# EAGLE design untitled (EAGLE 7.6.0)
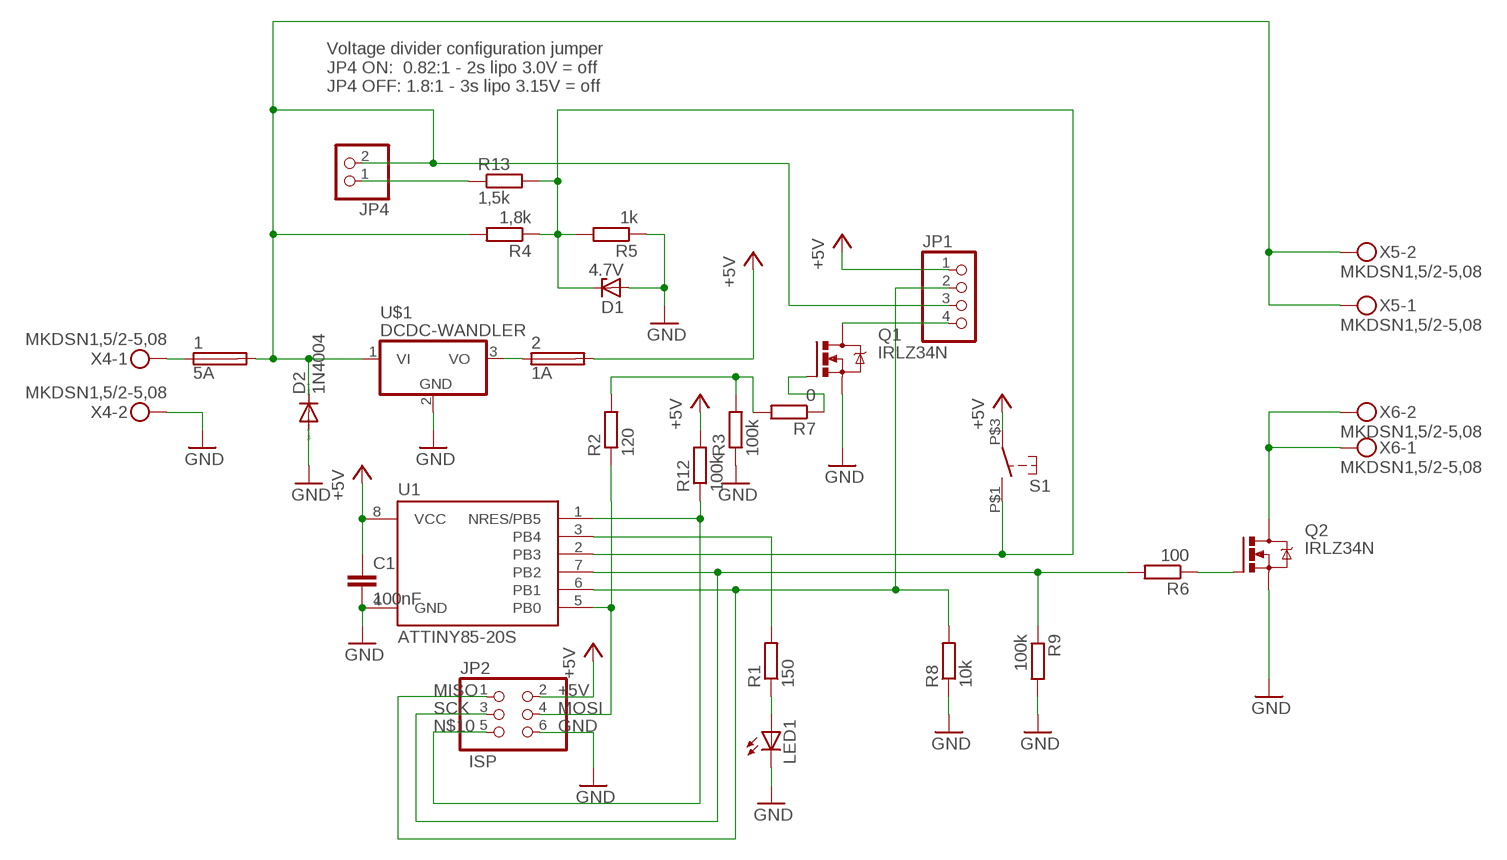
[diagram p0: schematic, sheet 1]

## Parts
1  5A  FUSESH22,5A  [SH22,5A]
2  1A  FUSESH22,5A  [SH22,5A]
C1  100nF  C-EUC0805  [C0805]
D1  4.7V  ZENER-DIODESOT23  [SOT23]
D2  1N4004  [DO41-10]
JP1  PINHD-1X4  [1X04]
JP2  PINHD-2X3  [2X03]
JP4  PINHD-1X2  [1X02]
LED1  LED3MM  [LED3MM]
Q1  IRLZ34N  IRLZ44Z  [TO220BH]
Q2  IRLZ34N  IRLZ44Z  [TO220BH]
R1  150  R-EU_R1206  [R1206]
R2  120  R-EU_R1206  [R1206]
R3  100k  R-EU_R1206  [R1206]
R4  1,8k  R-EU_R1206  [R1206]
R5  1k  R-EU_R1206  [R1206]
R6  100  R-EU_R1206  [R1206]
R7  0  R-EU_R1206  [R1206]
R8  10k  R-EU_R1206  [R1206]
R9  100k  R-EU_R1206  [R1206]
R12  100k  R-EU_R1206  [R1206]
R13  1,5k  R-EU_R1206  [R1206]
S1  SCHLIESSER_TASTSCHALTER  [NAMAE-JTP-1130]
U1  ATTINY85-20S  [SOIC8_EIAJ_208MIL]
U$1  DCDC-WANDLER  [TRACOPOWER-DCDCWANDER-TSR1]
X4  MKDSN1,5/2-5,08  [MKDSN1,5/2-5,08]
X5  MKDSN1,5/2-5,08  [MKDSN1,5/2-5,08]
X6  MKDSN1,5/2-5,08  [MKDSN1,5/2-5,08]

## Nets
+5V: 2.2 C1.1 JP1.1 JP2.2 R12.2 S1.P$3 U1.8(VCC)
GND: C1.2 D1.1(A) D2.A JP2.6 LED1.K(C) Q1.S Q2.S R3.1 R5.1 R8.1 R9.2 U1.4(GND) U$1.2(GND) X4.2
MISO: JP1.2 JP2.1 R8.2 U1.6(PB1)
MOSI: JP2.4 R2.1 U1.5(PB0)
N$1: 1.1 X4.1
N$2: 1.2 D2.C JP1.3 JP4.2 R4.2 U$1.1(VI) X5.1 X5.2
N$3: Q2.D X6.1 X6.2
N$4: Q2.G R6.1
N$6: LED1.A R1.1
N$7: Q1.G R7.1
N$8: R2.2 R3.2 R7.2
N$10: JP2.5 R12.1 U1.1(NRES/PB5)
N$12: R1.2 U1.3(PB4)
N$16: JP4.1 R13.1
N$18: 2.1 U$1.3(VO)
N$21: JP1.4 Q1.D
RESET: D1.3(C) R4.1 R5.2 R13.2 S1.P$1 U1.2(PB3)
SCK: JP2.3 R6.2 R9.1 U1.7(PB2)

## Notes on the sheet
- Voltage divider configuration jumper
  JP4 ON:  0.82:1 - 2s lipo 3.0V = off
  JP4 OFF: 1.8:1 - 3s lipo 3.15V = off
- ISP

## Library data of the parts
1 2 = 0liver:FUSE: Fuse; OC_FARNELL: unknown; OC_NEWARK: unknown
C1 = rcl:C-EU: CAPACITOR, European symbol
D1 = diode:ZENER-DIODE: Z-Diode
D2 = diode:1N4004: DIODE general purpose rectifier, 1 A
JP1 = pinhead:PINHD-1X4: PIN HEADER
JP2 = pinhead:PINHD-2X3: PIN HEADER
JP4 = pinhead:PINHD-1X2: PIN HEADER
LED1 = led:LED: LED OSRAM: - CHIPLED LG R971, LG N971, LY N971, LG Q971, LY Q971, LO R971, LY R971 LH N974, LH R974 LS Q976, LO Q976, LY Q976 LO Q996 - Hyper CHIPLED LW Q18S LB Q993, LB Q99A, LB R99A - SideLED LS A670, LO A670, LY A670, LG A670, LP A670 LB A673, LV A673, LT A673, LW A673 LH A674 LY A675 LS A676, LA A676, LO A676, LY A676, LW A676 LS A679, LY A679, LG A679 - Hyper Micro SIDELED® LS Y876, LA Y876, LO Y876, LY Y876 LT Y87S - SmartLED LW L88C, LW L88S LB L89C, LB L89S, LG L890 LS L89K, LO L89K, LY L89K LS L896, LA L896, LO L896, LY L896 - TOPLED LS T670, LO T670, LY T670, LG T670, LP T670 LSG T670, LSP T670, LSY T670, LOP T670, LYG T670 LG T671, LOG T671, LSG T671 LB T673, LV T673, LT T673, LW T673 LH T674 LS T676, LA T676, LO T676, LY T676, LB T676, LH T676, LSB T676, LW T676 LB T67C, LV T67C, LT T67C, LS T67K, LO T67K, LY T67K, LW E67C LS E67B, LA E67B, LO E67B, LY E67B, LB E67C, LV E67C, LT E67C LW T67C LS T679, LY T679, LG T679 LS T770, LO T770, LY T770, LG T770, LP T770 LB T773, LV T773, LT T773, LW T773 LH T774 LS E675, LA E675, LY E675, LS T675 LS T776, LA T776, LO T776, LY T776, LB T776 LHGB T686 LT T68C, LB T68C - Hyper Mini TOPLED® LB M676 - Mini TOPLED Santana® LG M470 LS M47K, LO M47K, LY M47K Source: http://www.osram.convergy.de LUXEON: - LUMILED® LXK2-PW12-R00, LXK2-PW12-S00, LXK2-PW14-U00, LXK2-PW14-V00 LXK2-PM12-R00, LXK2-PM12-S00, LXK2-PM14-U00 LXK2-PE12-Q00, LXK2-PE12-R00, LXK2-PE12-S00, LXK2-PE14-T00, LXK2-PE14-U00 LXK2-PB12-K00, LXK2-PB12-L00, LXK2-PB12-M00, LXK2-PB14-N00, LXK2-PB14-P00, LXK2-PB14-Q00 LXK2-PR12-L00, LXK2-PR12-M00, LXK2-PR14-Q00, LXK2-PR14-R00 LXK2-PD12-Q00, LXK2-PD12-R00, LXK2-PD12-S00 LXK2-PH12-R00, LXK2-PH12-S00 LXK2-PL12-P00, LXK2-PL12-Q00, LXK2-PL12-R00 Source: www.luxeon.com KINGBRIGHT: KA-3528ASYC Source: www.kingbright.com
Q1 Q2 = 0liver:IRLZ44Z: N-Channel HEXFET® Power MOSFET Logic Level AUTOMOTIVE MOSFET Source: http://www.irf.com/product-info/datasheets/data/irlz44zpbf.pdf
R1-R9 R12 R13 = rcl:R-EU_: RESISTOR, European symbol
S1 = 0liver:SCHLIESSER_TASTSCHALTER: Tastschalter, Schließer
U1 = _hhn_attiny25_45_85:ATTINY85*: ATMEL ATtiny 85 Packages: P = PDIP 08 30mil S = SOIC 08 EIAJ 208mil Technologies Note: for complete ordering code (temp. range, finish, tape&reel etc.) see www.atmel.com • Supply Voltage: V = (1.8…5.5)V | [blank] = (2.7…5.5)V • Speed: 10 = 10 MHz | 20 = 20 MHz Author: Dipl.-Ing. FH Rainer Bayer HHN Hochschule Heilbronn (Heilbronn University), rainer.bayer@hs-heilbronn.de Ingenieurbüro ing-rb, mail@ing-rb.de
U$1 = 0liver:DCDC-WANDLER
X4-X6 = con-phoenix-508:MKDSN1,5/2-5,08: MKDSN 1,5/ 2-5,08 Printklemme Nennstrom: 13,5 A Nennspannung: 250 V Rastermaß: 5,08 mm Polzahl: 2 Anschlussart: Schraubanschluss Montage: Löten Anschlussrichtung Leiter/Platine: 0 ° Artikelnummer: 1729128 Source: http://eshop.phoenixcontact.com .. 1729128.pdf

## Board
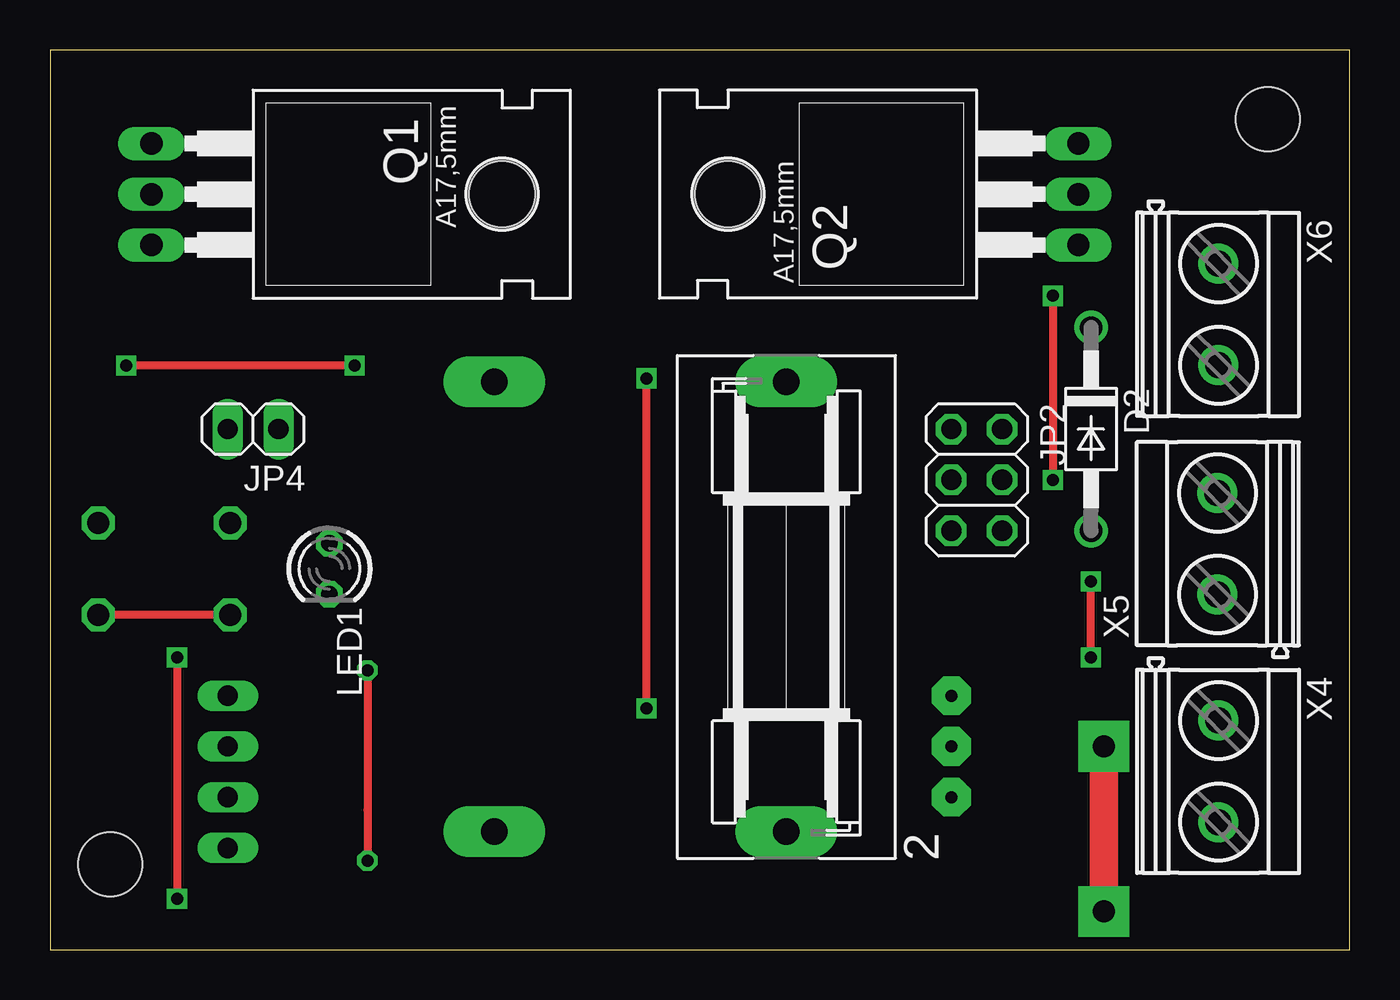
[diagram p1: board, top side]
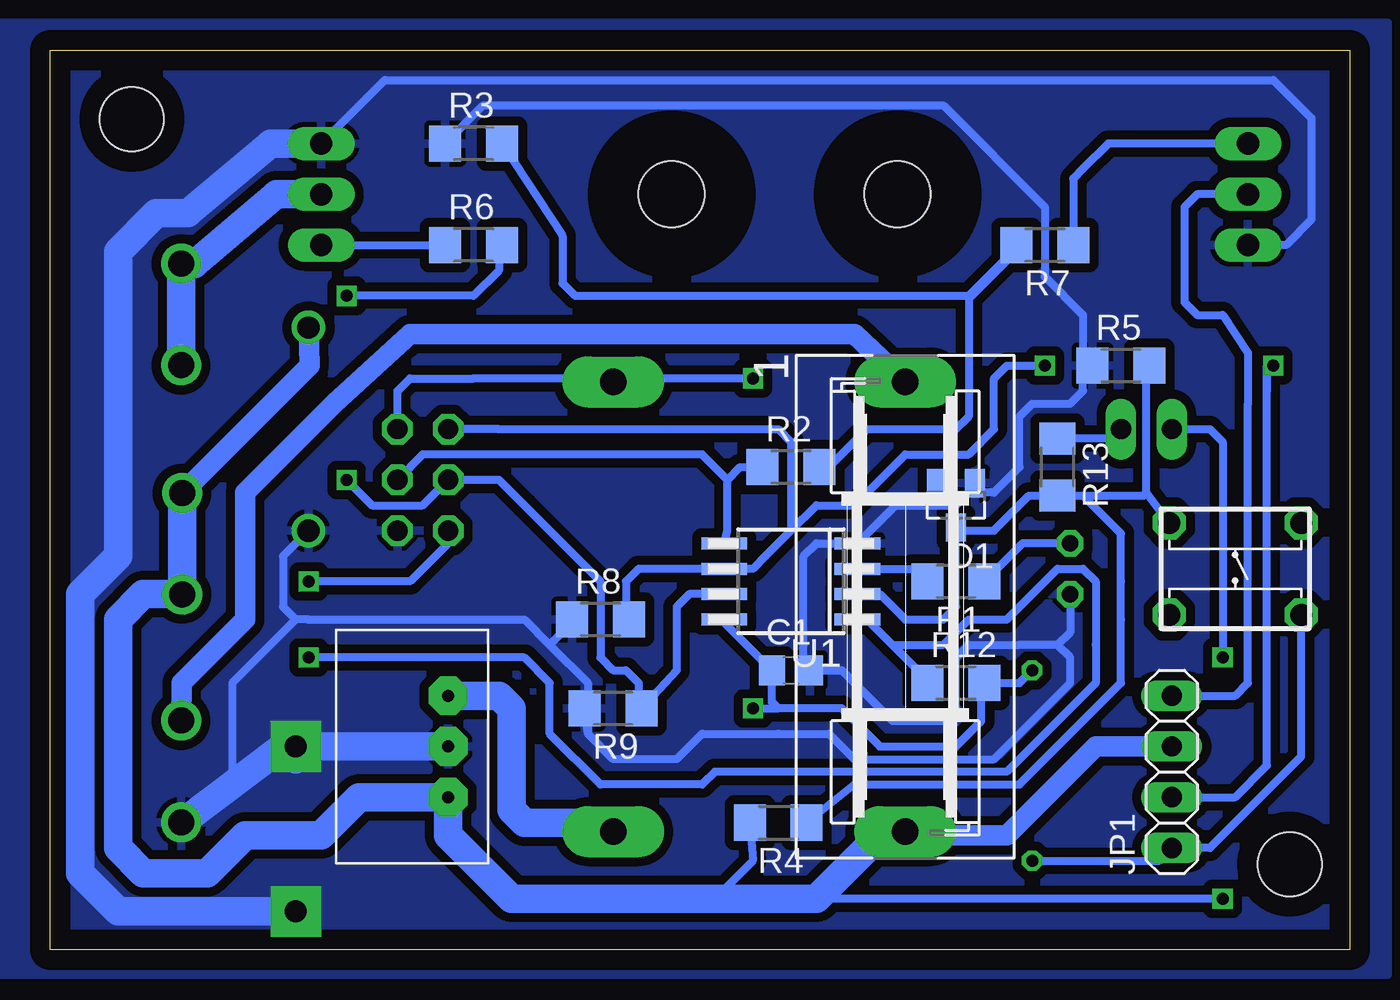
[diagram p2: board, bottom side, seen from below]

Size 65 x 45 mm. Coordinates in mm from the lower left corner, seen from the top.
Outline: 0,0 65,0 65,45 0,45 0,0
Copper layers (1*16): Top 0.035mm / dielectric 1.5mm / Bottom 0.035mm
Design rules "default *": minimum track width 10mil, minimum drill 24mil, track to track 18mil, track to pad 18mil, pad to pad 18mil, via to via 18mil, smd to smd 8mil, copper to edge 40mil, drill to drill 8mil, minimum pad ring 10mil, minimum via ring 8mil, stop-mask expansion 4mil, vias tented up to drill 0mil, thermal gap 10mil
Holes 3.2 mm at 60.91,41.54 3,4.27

### Footprints (pad centres in the part's own frame; a part is rotated, then mirrored left to right if it is on the bottom)
SH22,5A = drill 1.321 pad 2.54 long: 1 -11.252,0; 2 11.252,0
C0805 = smd 1.3 x 1.5: 1 -0.95,0; 2 0.95,0
SOT23 = smd 1 x 1.4: 1 -0.95,-1.1; 2 0.95,-1.1; 3 0,1.1
DO41-10 = drill 1.118: A 5.08,0; C -5.08,0
1X04 = drill 1.016 long: 1 -3.81,0; 2 -1.27,0; 3 1.27,0; 4 3.81,0
2X03 = drill 1.016 octagon: 1 -2.54,-1.27; 2 -2.54,1.27; 3 0,-1.27; 4 0,1.27; 5 2.54,-1.27; 6 2.54,1.27
1X02 = drill 1.016 long: 1 -1.27,0; 2 1.27,0
LED3MM = drill 0.813 octagon: A -1.27,0; K 1.27,0
TO220BH = drill 1.118 long: D 0,-6.35; G -2.54,-6.35; S 2.54,-6.35 | hole 3.302: 0,11.176
R1206 = smd 1.6 x 1.803: 1 -1.422,0; 2 1.422,0
NAMAE-JTP-1130 = drill 1.1 octagon: P$1 3.3,-2.3; P$2 -3.3,-2.3; P$3 3.3,2.3; P$4 -3.3,2.3
SOIC8_EIAJ_208MIL = smd 0.6 x 2.286: 1 -1.905,-3.33; 2 -0.635,-3.33; 3 0.635,-3.33; 4 1.905,-3.33; 5 1.905,3.33; 6 0.635,3.33; 7 -0.635,3.33; 8 -1.905,3.33
TRACOPOWER-DCDCWANDER-TSR1 = drill 0.6 pad 1.93 octagon: 1 0,0; 2 2.54,0; 3 5.08,0
MKDSN1,5/2-5,08 = drill 1.3 pad 2: 1 -2.561,0.025; 2 2.519,0.025

### Placement (x,y rotation side)
1  22.23,17.14 270 bottom
2  36.83,17.14 90 top
C1  27.94,13.97 0 bottom
D1  19.68,22.23 180 bottom
D2  52.07,26.04 270 top
JP1  8.89,8.89 90 bottom
JP2  46.35,23.5 270 top
JP4  10.16,26.04 180 top
LED1  13.97,19.05 270 top
Q1  11.43,37.78 270 top
Q2  45.09,37.78 90 top
R1  19.68,18.41 180 bottom
R2  27.94,24.13 0 bottom
R3  43.81,40.32 0 bottom
R4  28.57,6.35 180 bottom
R5  11.43,29.21 0 bottom
R6  43.81,35.24 0 bottom
R7  15.24,35.24 180 bottom
R8  37.47,16.51 0 bottom
R9  36.83,12.06 180 bottom
R12  19.68,13.34 0 bottom
R13  14.61,24.13 270 bottom
S1  5.71,19.05 180 bottom
U1  27.94,18.41 90 bottom
U$1  45.09,7.62 90 bottom
X4  58.42,8.89 270 top
X5  58.42,20.32 90 top
X6  58.42,31.75 270 top

### Tracks (layer width: path | path; a pad name or v marks a point on that pad's centre or on a via)
+5V  (via drill 0.6, 0.6 pad 0.61)
  Top 0.406: v15.88,13.97 15.88,6.99 v15.88,4.45 | S1.P$3 2.78,16.75 v2.42,16.75 | v29.84,12.06 v29.84,28.57
  Bottom 0.406: 31.11,16.51 U1.8 31.27,16.35 C1.1 28.89,12.38 28.57,12.06 | v15.88,13.97 16.51,13.34 R12.2 18.41,13.97 18.41,11.43 19.68,10.16 23.5,10.16 25.4,12.06 28.57,12.06 | v15.88,4.45 9.53,4.45 JP1.1 6.99,5.08 2.42,9.65 v2.42,16.75 | 2.2 38.1,28.57 43.81,28.57 46.99,28.57 47.62,27.94 JP2.2 | 2.2 36.65,28.57 | v29.84,28.57 33.02,28.57 35.56,28.57 35.74,28.4 2.2 | v29.84,12.06 28.57,12.06
GND  (via drill 1.1 pad 2.54)
  Top 1.422: v52.7,1.91 v52.7,10.16
  Bottom 0.406: 14.61,15.24 13.97,14.61 13.97,13.34 15.88,11.43 17.78,9.53 24.77,9.53 26.04,10.79 28.57,10.79 32.38,10.79 33.66,9.53 36.83,9.53 38.1,10.79 | 14.61,15.24 16.51,15.24 19.05,15.24 19.68,14.61 19.68,12.06 20.32,11.43 22.86,11.43 25.4,13.97 C1.2 27.3,13.97 27.3,15.24 27.3,15.88 27.3,19.68 26.67,20.32 U1.4 22.7,22.23 19.68,22.23 19.05,22.86 | 38.1,10.79 38.1,12.06 | 38.1,12.06 R9.2 38.1,10.79 | U$1.2 46.35,10.16 | 40.01,15.24 41.27,16.51 52.07,16.51 52.7,16.51 | 40.01,15.24 38.1,13.34 38.1,12.06 | 38.1,12.06 38.1,10.79 | R8.1 38.73,16.51 40.01,15.24 | 52.7,16.51 55.88,13.34 55.88,7.62 58.42,6.35 | LED1.K 13.97,15.88 14.61,15.24 | Q2.S 48.26,43.5 3.81,43.5 1.91,41.59 1.91,36.51 3.17,35.24 Q1.S | R3.1 43.33,42.23 20.32,42.23 15.24,37.15 15.24,33.66 13.34,31.75 13.34,29.69 R5.1 | 19.05,22.86 18.73,23.18 D1.1 | 19.05,22.86 17.78,22.86 16.51,24.13 16.51,26.67 15.88,27.3 13.97,27.3 13.34,27.94 13.34,28.73 R5.1 | 12.85,29.36 R5.1 | D2.A 53.34,19.68 53.34,17.14 52.7,16.51
  Bottom 1.422: U$1.2 46.35,10.16 50.16,10.16 53.34,10.16 | 53.34,10.16 58.42,6.35 X4.2 | Q2.S 53.98,40.32 58.1,36.83 59.69,36.83 61.59,34.92 61.59,19.68 63.5,17.78 63.5,3.81 61.59,1.91 v52.7,1.91 | v52.7,10.16 52.7,9.53 53.34,10.16
  pour Bottom: -0.64,46.35 66.67,46.35 66.67,-1.27 -1.27,-1.27 -1.27,46.35
MISO  (via drill 0.6)
  Top 0.406: v15.24,29.21 v3.81,29.21
  Bottom 0.406: 27.94,25.4 28.57,26.04 29.84,26.04 41.91,26.04 42.55,26.04 JP2.1 | 27.94,25.4 27.94,20.95 | 27.94,20.95 29.21,19.68 29.84,19.05 U1.6 35.56,19.05 36.2,18.41 36.2,16.51 R8.2 | JP1.2 5.71,7.62 4.13,9.21 4.13,27.94 | 4.13,27.94 4.13,29.21 | 4.13,29.21 4.13,27.94 | 27.94,25.4 27.94,20.95 | 27.94,20.95 26.67,22.23 24.77,22.23 22.23,24.77 19.05,24.77 17.78,26.04 17.78,28.57 17.14,29.21 v15.24,29.21 | v3.81,29.21 4.13,29.21
MOSI
  Bottom 0.406: U1.5 31.11,20.95 | 31.11,20.95 31.11,23.5 | 31.11,23.5 30.48,24.13 R2.1 | 31.11,20.95 31.11,23.5 | 31.11,23.5 32.38,24.77 46.35,24.77 JP2.4
N$1
  Bottom 1.016: X4.1 58.42,13.34 55.24,16.51 55.24,22.86 50.8,27.3 46.99,30.8 44.13,30.8 24.77,30.8 1.1
N$2  (via drill 0.6)
  Top 0.406: v6.35,14.61 v6.35,2.54
  Bottom 0.406: R4.2 29.84,4.45 31.75,2.54 | 7.62,10.16 JP1.3 | JP1.3 9.53,10.16 JP1.3 | JP4.2 6.99,26.04 6.35,25.4 v6.35,14.61 | v6.35,2.54 26.67,2.54
  Bottom 1.016: JP1.3 12.7,10.16 17.14,5.71 22.05,5.71 1.2 | D2.C 52.02,29.21 X5.2
  Bottom 1.422: X5.2 X5.1 58.42,17.78 60.33,17.78 61.59,16.51 61.59,5.08 60.33,3.81 57.15,3.81 55.24,5.71 51.44,5.71 49.53,7.62 U$1.1 45.09,5.71 41.91,2.54 31.75,2.54 26.67,2.54 25.4,3.81 23.5,5.71 1.2
N$3
  Bottom 1.422: X6.2 X6.1 58.42,34.29 57.78,34.29 53.66,37.78 | Q2.D 52.07,37.78 | 52.07,37.78 53.66,37.78 | 53.66,37.78 52.07,37.78 | 52.07,37.78 53.66,37.78
N$4
  Bottom 0.406: Q2.G R6.1
N$5
  pour Bottom: -1.91,46.35 69.22,46.35 69.22,-1.27 -1.91,-1.27
N$6
  Bottom 0.406: 18.41,18.41 R1.1 16.36,20.32 LED1.A
N$7
  Bottom 0.406: Q1.G 12.06,40.32 13.34,39.05 13.82,38.57 R7.1
N$8
  Bottom 0.406: R2.2 26.04,24.13 24.13,26.04 19.68,26.04 19.05,26.67 19.05,32.55 | R3.2 39.37,35.71 39.37,33.34 38.73,32.7 19.05,32.7 | 19.05,32.55 19.05,32.7 | 19.05,32.7 19.05,32.55 | 19.05,32.7 16.66,35.09 | 16.66,35.09 R7.2 16.66,35.09 | 19.05,32.55 16.66,34.94 16.66,35.09
N$10  (via drill 0.6)
  Top 0.406: v52.07,14.61 v52.07,18.41
  Bottom 0.406: 24.13,16.51 U1.1 24.13,16.51 | 24.13,16.51 22.86,15.24 | 24.13,16.51 22.86,15.24 | 22.86,15.24 20.32,15.24 19.05,16.51 17.14,16.51 15.88,17.78 14.61,19.05 13.34,19.05 12.7,18.41 12.7,15.24 12.7,13.34 17.14,8.89 24.13,8.89 25.4,8.89 27.94,8.89 31.75,8.89 32.38,8.26 37.47,8.26 40.01,10.79 40.01,13.34 41.27,14.61 v52.07,14.61 | R12.1 20.95,13.34 22.86,15.24 | v52.07,18.41 50.16,18.41 46.99,18.41 45.09,20.32 JP2.5
N$12
  Bottom 0.406: U1.3 21.74,19.05 R1.2
N$16
  Bottom 0.406: JP4.1 11.91,25.55 R13.1
N$18
  Bottom 1.422: U$1.3 43.81,12.7 42.55,12.7 41.91,12.06 41.91,6.99 41.27,6.35 37.47,6.35 2.1
N$21
  Bottom 0.406: JP1.4 5.71,12.7 5.08,13.34 5.08,27.3 5.08,29.84 6.35,31.75 7.62,31.75 8.26,32.38 8.26,37.15 7.62,37.78 Q1.D
RESET
  Bottom 0.406: U1.2 23.5,17.78 22.23,16.51 20.32,16.51 19.68,17.14 D1.3 19.52,20.95 17.78,20.95 16.03,22.71 R13.2 | 27.3,6.35 R4.1 24.77,8.26 16.51,8.26 11.43,13.34 11.43,16.51 11.43,18.41 11.43,20.8 13.34,22.71 | 10.16,22.86 S1.P$1 | 10.16,22.86 10.16,28.57 R5.2 | 14.92,22.39 R13.2 | R13.2 13.34,22.71 | 13.34,22.71 10.31,22.71 10.16,22.86
SCK  (via drill 0.6)
  Top 0.406: v50.16,32.7 v50.16,23.5
  Bottom 0.406: U1.7 33.02,17.78 33.66,17.14 33.66,13.97 R9.1 35.56,12.06 35.56,13.34 36.2,13.97 36.83,13.97 37.47,14.61 37.47,18.41 41.27,22.23 42.55,23.5 JP2.3 46.35,22.23 48.9,22.23 v50.16,23.5 | R6.2 42.55,35.09 42.55,33.97 43.81,32.7 v50.16,32.7

### Text on the board
Dimension: Spannungsversorgungsmodul v2.1 09/16